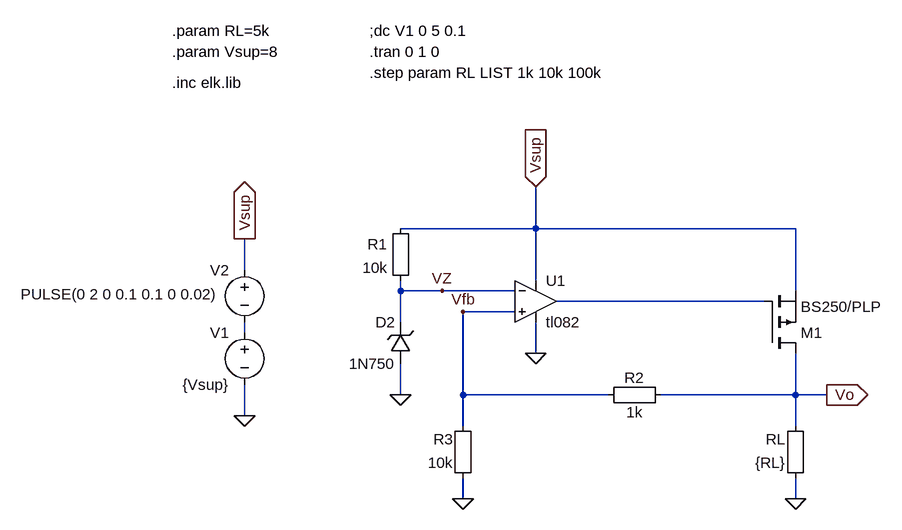
[diagram p0: schematic 10_1_TW.asc]
10_1_TW.asc, the LTspice schematic file:
Version 4
SHEET 1 1112 680
WIRE 128 144 128 80
WIRE 128 144 -80 144
WIRE 528 144 128 144
WIRE -320 208 -320 160
WIRE 128 224 128 144
WIRE -80 240 -80 224
WIRE -16 240 -80 240
WIRE 96 240 -16 240
WIRE 528 240 528 144
WIRE 480 256 160 256
WIRE 96 272 16 272
WIRE -80 288 -80 240
WIRE -320 304 -320 288
WIRE 128 336 128 288
WIRE -80 400 -80 352
WIRE 16 400 16 272
WIRE 240 400 16 400
WIRE 528 400 528 336
WIRE 528 400 320 400
WIRE 576 400 528 400
WIRE -320 432 -320 384
WIRE 16 448 16 400
WIRE 528 448 528 400
WIRE 16 560 16 528
WIRE 528 560 528 528
FLAG 16 560 0
FLAG 528 560 0
FLAG 128 336 0
FLAG -80 400 0
FLAG -320 432 0
FLAG -320 160 Vsup
IOPIN -320 160 Out
FLAG 128 80 Vsup
IOPIN 128 80 In
FLAG 576 400 Vo
IOPIN 576 400 Out
FLAG -16 240 VZ
FLAG 16 272 Vfb
SYMBOL Misc\\EuropeanResistor -64 128 M0
SYMATTR InstName R1
SYMATTR Value 10k
SYMBOL Misc\\EuropeanResistor 336 384 R90
WINDOW 0 5 56 VBottom 2
WINDOW 3 27 56 VTop 2
SYMATTR InstName R2
SYMATTR Value 1k
SYMBOL Misc\\EuropeanResistor 32 544 R180
WINDOW 0 31 76 Left 2
WINDOW 3 31 40 Left 2
SYMATTR InstName R3
SYMATTR Value 10k
SYMBOL Misc\\EuropeanResistor 544 544 R180
WINDOW 0 31 76 Left 2
WINDOW 3 31 40 Left 2
SYMATTR InstName RL
SYMATTR Value {RL}
SYMBOL pmos 480 336 M180
SYMATTR InstName M1
SYMATTR Value BS250/PLP
SYMATTR Prefix X
SYMBOL Opamps\\opamp2 128 192 R0
SYMATTR InstName U1
SYMATTR Value tl082
SYMBOL voltage -320 192 M0
WINDOW 3 41 53 Left 2
WINDOW 123 0 0 Left 0
WINDOW 39 0 0 Left 0
SYMATTR Value PULSE(0 2 0 0.1 0.1 0 0.02)
SYMATTR InstName V2
SYMBOL voltage -320 288 M0
WINDOW 123 0 0 Left 0
WINDOW 39 0 0 Left 0
SYMATTR InstName V1
SYMATTR Value {Vsup}
SYMBOL zener -64 352 R180
WINDOW 0 24 64 Left 2
WINDOW 3 24 0 Left 2
SYMATTR InstName D2
SYMATTR Value 1N750
TEXT -128 -128 Left 2 !.tran 0 1 0
TEXT -432 -80 Left 2 !.inc elk.lib
TEXT -128 -160 Left 2 !;dc V1 0 5 0.1
TEXT -432 -160 Left 2 !.param RL=5k
TEXT -432 -128 Left 2 !.param Vsup=8
TEXT -128 -96 Left 2 !.step param RL LIST 1k 10k 100k

The netlist it stands for:
* 10_1_TW.asc
R1 Vsup VZ 10k
R2 Vo Vfb 1k
R3 0 Vfb 10k
RL 0 Vo {RL}
XM1 Vo N001 Vsup BS250/PLP  ; pins D G S
XU1 Vfb VZ Vsup 0 N001 tl082  ; pins In+ In- V+ V- OUT
V2 Vsup N002 PULSE(0 2 0 0.1 0.1 0 0.02)
V1 N002 0 {Vsup}
D2 0 VZ 1N750
.model D D
.lib standard.dio
.tran 0 1 0
.inc elk.lib
;dc V1 0 5 0.1
.param RL=5k
.param Vsup=8
.step param RL LIST 1k 10k 100k
.backanno
.end